# Altium schematic sheet [3] Sensor.SchDoc: Sensors
size A4; ApprovedBy: Muhammet YILDIZ; CheckedBy: Muhammet YILDIZ; Author: Muhammet YILDIZ; CompanyName: YıLDıZ IoT; DrawnBy: Muhammet YILDIZ; Engineer: Muhammet YILDIZ; Organization: YıLDıZ IoT; Address1: Elperek Mahallesi; Address2: Saray Sokak No:12; Address3: SAKARYA / TURKEY; Revision: 1; SheetNumber: 3; SheetTotal: 7; SheetSize: A4
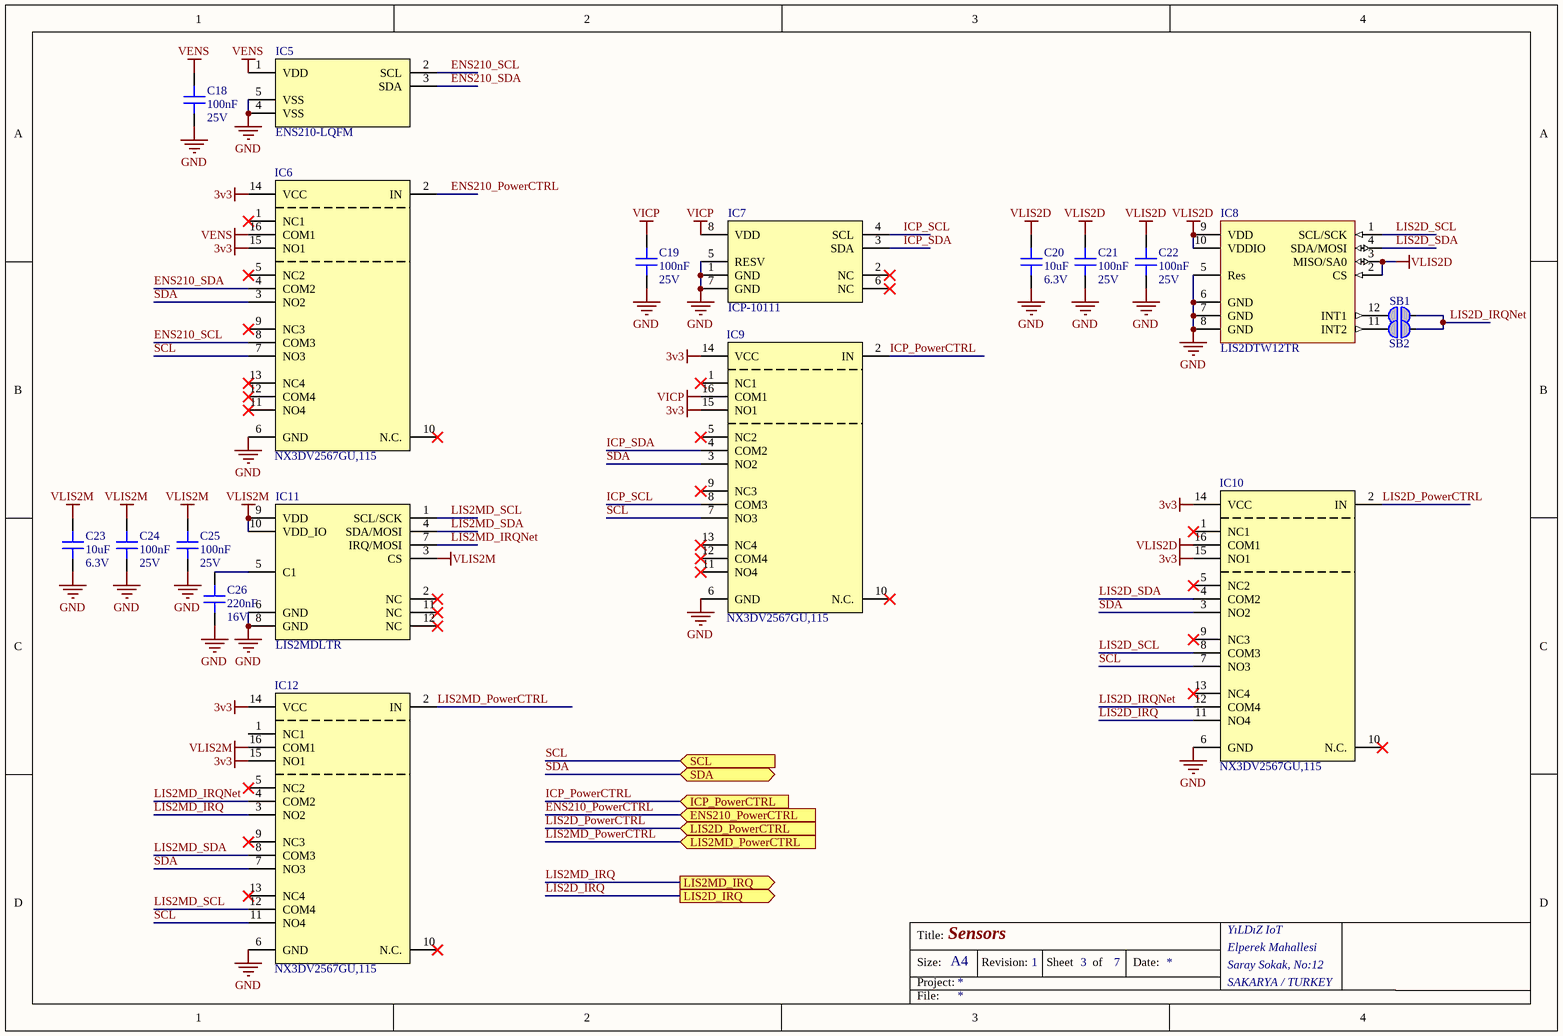
[diagram p0: [3] Sensor.SchDoc]

## Parts
C18  100nF  Voltage Rating (DC): 25V  [CAP 0402/1005]
C19  100nF  Voltage Rating (DC): 25V  [CAP 0402/1005]
C20  10uF  Voltage Rating: 6.3V  [CAP 0402/1005]
C21  100nF  Voltage Rating (DC): 25V  [CAP 0402/1005]
C22  100nF  Voltage Rating (DC): 25V  [CAP 0402/1005]
C23  10uF  Voltage Rating: 6.3V  [CAP 0402/1005]
C24  100nF  Voltage Rating (DC): 25V  [CAP 0402/1005]
C25  100nF  Voltage Rating (DC): 25V  [CAP 0402/1005]
C26  220nF  Voltage Rating: 16V  [CAP 0402/1005]
IC5  ENS210-LQFM  [SCIONSENSE ENS210LQFM]
IC6  NX3DV2567GU,115  [NXP XQFN16]
IC7  ICP-10111  [TDK ICP10111]
IC8  LIS2DTW12TR  [ST LGA-12 2x2x0.7]
IC9  NX3DV2567GU,115  [NXP XQFN16]
IC10  NX3DV2567GU,115  [NXP XQFN16]
IC11  LIS2MDLTR  [ST LGA-12 2x2x0.7]
IC12  NX3DV2567GU,115  [NXP XQFN16]
SB1  (no value)  [Solderbridge-Circular]  (no BOM)
SB2  (no value)  [Solderbridge-Circular]  (no BOM)

## Ports
ENS210_PowerCTRL (in), ICP_PowerCTRL (in), LIS2D_IRQ (out), LIS2D_PowerCTRL (in), LIS2MD_IRQ (out), LIS2MD_PowerCTRL (in), SCL (in), SDA (bidir)

## Nets
3v3: IC6.14(VCC) IC6.15(NO1) IC9.14(VCC) IC9.15(NO1) IC10.14(VCC) IC10.15(NO1) IC12.14(VCC) IC12.15(NO1)
GND: C18.1 C19.1 C20.1 C21.1 C22.1 C23.1 C24.1 C25.1 C26.1 IC5.4(VSS) IC5.5(VSS) IC6.6(GND) IC7.1(GND) IC7.5(RESV) IC7.7(GND) IC8.5(Res) IC8.6(GND) IC8.7(GND) IC8.8(GND) IC9.6(GND) IC10.6(GND) IC11.6(GND) IC11.8(GND) IC12.6(GND)
VENS: C18.2 IC5.1(VDD) IC6.16(COM1)
VICP: C19.2 IC7.8(VDD) IC9.16(COM1)
VLIS2D: C20.2 C21.2 C22.2 IC8.2(CS) IC8.3(MISO/SA0) IC8.9(VDD) IC8.10(VDDIO) IC10.16(COM1)
VLIS2M: C23.2 C24.2 C25.2 IC11.3(CS) IC11.9(VDD) IC11.10(VDD_IO) IC12.16(COM1)
ENS210_PowerCTRL: IC6.2(IN) ; port ENS210_PowerCTRL
ENS210_SCL: IC5.2(SCL) IC6.8(COM3)
ENS210_SDA: IC5.3(SDA) IC6.4(COM2)
ICP_PowerCTRL: IC9.2(IN) ; port ICP_PowerCTRL
ICP_SCL: IC7.4(SCL) IC9.8(COM3)
ICP_SDA: IC7.3(SDA) IC9.4(COM2)
LIS2D_IRQ: IC10.11(NO4) ; port LIS2D_IRQ
LIS2D_IRQNet: IC10.12(COM4) SB1.2 SB2.2
LIS2D_PowerCTRL: IC10.2(IN) ; port LIS2D_PowerCTRL
LIS2D_SCL: IC8.1(SCL/SCK) IC10.8(COM3)
LIS2D_SDA: IC8.4(SDA/MOSI) IC10.4(COM2)
LIS2MD_IRQ: IC12.3(NO2) ; port LIS2MD_IRQ
LIS2MD_IRQNet: IC11.7(IRQ/MOSI) IC12.4(COM2)
LIS2MD_PowerCTRL: IC12.2(IN) ; port LIS2MD_PowerCTRL
LIS2MD_SCL: IC11.1(SCL/SCK) IC12.12(COM4)
LIS2MD_SDA: IC11.4(SDA/MOSI) IC12.8(COM3)
SCL: IC6.7(NO3) IC9.7(NO3) IC10.7(NO3) IC12.11(NO4) ; port SCL
SDA: IC6.3(NO2) IC9.3(NO2) IC10.3(NO2) IC12.7(NO3) ; port SDA
NetC26_2: C26.2 IC11.5(C1)
NetIC8_11: IC8.11(INT2) SB2.1
NetIC8_12: IC8.12(INT1) SB1.1

Not connected (* = marked no-connect by the designer): IC6 1(NC1)* 5(NC2)* 9(NC3)* 10(N.C.)* 11(NO4)* 12(COM4)* 13(NC4)*; IC7 2(NC)* 6(NC)*; IC9 1(NC1)* 5(NC2)* 9(NC3)* 10(N.C.)* 11(NO4)* 12(COM4)* 13(NC4)*; IC10 1(NC1)* 5(NC2)* 9(NC3)* 10(N.C.)* 13(NC4)*; IC11 2(NC)* 11(NC)* 12(NC)*; IC12 1(NC1) 5(NC2)* 9(NC3)* 10(N.C.)* 13(NC4)*

## Notes on the sheet
- Title:
- Size:
- Project:
- Revision:
- Sheet
- of
- Date:
- YıLDıZ IoT
- Elperek Mahallesi
- Saray Sokak, No:12
- SAKARYA / TURKEY
- File:

## Library data of the parts
C18 C19 C21 C22 C24 C25 = Capacitor - Ceramic: Cap Ceramic 0.1uF 25V X5R 10% Pad SMD 0402 85¡ãC T/R / Multi Layer Ceramic Capacitor (MLCC); Manufacturer: Samsung; Manufacturer Part Number: CL05A104KA5NNNC; Supplier 1: Digi-Key; Supplier Part Number 1: 1276-1043-6-ND; RoHS: Yes; Category: Ceramic Capacitors; Pricing 1: 1=0,10000, 10=0,01100, 50=0,00600, 100=0,00490, 500=0,00346, 1000=0,00272, 2500=0,00248, 5000=0,00228 (USD); Mount: Surface Mount; Case/Package: 0402; Case Code (Imperial): 0402; Case Code (Metric): 1005; Min Operating Temperature: -55°C; Max Operating Temperature: 85°C; Capacitance: 100nF; Packaging: Tape and Reel; Tolerance: 10%; Package Quantity: 1; Voltage Rating: 25V; Dielectric: X5R; Voltage: 25V; Length: 1mm; Width: 0.02inch; Height: 0.5mm; Thickness: 0.022inch; Depth: 0.5mm; Radiation Hardening: No; Lead Free: Lead Free; ComponentLink1URL: https://datasheet.ciiva.com/25802/cl05a104ka5nnnc-25802704.pdf?src-supplier=Digi-Key; ComponentLink1Description: https://datasheet.ciiva.com/25802/cl05a104ka5nnnc-25802704.pdf?src-supplier=Digi-Key; ComponentLink2URL: https://datasheet.ciiva.com/16437/cl05a104ka5nnnc-16437369.pdf?src-supplier=Future+Electronics; ComponentLink2Description: https://datasheet.ciiva.com/16437/cl05a104ka5nnnc-16437369.pdf?src-supplier=Future+Electronics; ComponentLink3URL: https://datasheet.ciiva.com/26838/getdatasheetpartid-357412-26838142.pdf?src-supplier=Verical; ComponentLink3Description: https://datasheet.ciiva.com/26838/getdatasheetpartid-357412-26838142.pdf?src-supplier=Verical; ComponentLink4URL: https://datasheet.ciiva.com/26309/mlcc-catalogdownload2013-eng-26309014.pdf?src-supplier=Distrelec; ComponentLink4Description: https://datasheet.ciiva.com/26309/mlcc-catalogdownload2013-eng-26309014.pdf?src-supplier=Distrelec
C20 C23 = Capacitor - Ceramic: 0402 10 uF 6.3 V ±20 % Tolerance X5R Surface Mount Multilayer Ceramic Capacitor; Manufacturer: Murata; Manufacturer Part Number: GRM155R60J106ME15D; Tolerance: 20%; Supplier 1: Digi-Key; Supplier Part Number 1: 490-13238-1-ND; RoHS: Yes; Category: Ceramic Capacitors; Pricing 1: 1=0,18000, 10=0,12400, 50=0,07440, 100=0,06280, 500=0,04296, 1000=0,03800, 2500=0,03635, 5000=0,03304 (USD); Mount: Surface Mount; Case/Package: 0402; Case Code (Metric): 1005; Case Code (Imperial): 0402; Min Operating Temperature: -55°C; Max Operating Temperature: 85°C; Packaging: Tape and Reel; Capacitance: 10uF; Voltage Rating (DC): 6.3V; Dielectric: X5R; Length: 0.039inch; Width: 0.02inch; Thickness: 0.026inch; RoHS Compliant: Yes; ComponentLink1URL: https://www.murata.com/~/media/webrenewal/support/library/catalog/products/capacitor/mlcc/c02e.ashx?la=en-us&src-supplier=Digi-Key; ComponentLink1Description: https://www.murata.com/~/media/webrenewal/support/library/catalog/products/capacitor/mlcc/c02e.ashx?la=en-us&src-supplier=Digi-Key
C26 = Capacitor - Ceramic: Ceramic capacitor SMD-0402 220nF /16V X7R# K +-10%, Samsung, RoHS; Manufacturer Part Number: CL05B224KO5NNNC; Tolerance: 10%; Dielectric: X7R; Supplier 1: Digi-Key; Supplier Part Number 1: 1276-1176-1-ND; Manufacturer: Samsung; RoHS: Yes; Category: Ceramic Capacitors; Pricing 1: 1=0,10000, 10=0,03300, 50=0,01780, 100=0,01460, 500=0,01040, 1000=0,00817, 2500=0,00742, 5000=0,00683 (USD); Mount: Surface Mount; Case/Package: 0402; Case Code (Metric): 1005; Case Code (Imperial): 0402; Min Operating Temperature: -55°C; Max Operating Temperature: 125°C; Packaging: Tape and Reel; Capacitance: 220nF; Package Quantity: 1; Series: CL; Construction: Flat; Length: 1mm; Width: 0.02inch; Height: 0.5mm; Thickness: 0.022inch; Depth: 0.5mm; Radiation Hardening: No; RoHS Compliant: Yes; ComponentLink1URL: https://datasheet.ciiva.com/25800/cl05b224ko5nnnc-25800450.pdf?src-supplier=Digi-Key; ComponentLink1Description: https://datasheet.ciiva.com/25800/cl05b224ko5nnnc-25800450.pdf?src-supplier=Digi-Key; ComponentLink2URL: https://datasheet.ciiva.com/26838/getdatasheetpartid-358459-26838228.pdf?src-supplier=Verical; ComponentLink2Description: https://datasheet.ciiva.com/26838/getdatasheetpartid-358459-26838228.pdf?src-supplier=Verical; ComponentLink3URL: https://datasheet.ciiva.com/16428/cl05b224ko5nnnc-16428810.pdf?src-supplier=Future+Electronics; ComponentLink3Description: https://datasheet.ciiva.com/16428/cl05b224ko5nnnc-16428810.pdf?src-supplier=Future+Electronics
IC5 = SCIOSENSE ENS210-LQFM: ENS210 Series 3.6V 100%RH Relative Humidity & Temperature Sensor w/I²C Interface; Supplier 1: Digi-Key; Supplier Part Number 1: 2618-ENS210-LQFMCT-ND; Manufacturer: ScioSense; Manufacturer Part Number: ENS210-LQFM; Stock 1: 47662; Pricing 1: 1=2,87000, 5=2,66400, 10=2,21400, 25=1,84480, 50=1,64000, 100=1,55800, 500=1,31200, 1000=1,23000 (USD); ComponentLink1URL: https://datasheet.octopart.com/ENS210-LQFM-ScioSense-datasheet-149899868.pdf?src-supplier=Future+Electronics; ComponentLink1Description: https://datasheet.octopart.com/ENS210-LQFM-ScioSense-datasheet-149899868.pdf?src-supplier=Future+Electronics
IC6 IC9 IC10 IC12 = NXP NX3DV2567GU,115: NX3DV2567 Series 4.3 V 10.5 Ohm 4PDT Low-Ohmic Analog Switch - XQFN-16; Manufacturer: NXP Semiconductors; Number of Inputs: 4; Number of Outputs: 2; Number of Channels: 1; Min Supply Voltage: 1.4V; Max Supply Voltage: 4.3V; Max Power Dissipation: 250mW; On-State Resistance: 700mR; Operating Supply Current: 150nA; Turn-On Delay Time: 50ns; Turn-Off Delay Time: 30ns; Supply Type: Single; Supplier 1: Digi-Key; Supplier Part Number 1: 568-5206-1-ND; Manufacturer Part Number: NX3DV2567GU,115; RoHS: Yes; Category: Interface ICs; Stock 1: 5231; Pricing 1: 1=0,98000, 10=0,87300, 25=0,82880, 100=0,80340 (USD); Mount: Surface Mount; Number of Pins: 16; Min Operating Temperature: -40°C; Max Operating Temperature: 125°C; Package Quantity: 1; Packaging: Tape and Reel; Max Supply Current: 150nA; Power Dissipation: 250mW; Series: -; Radiation Hardening: No; Lead Free: Lead Free; RoHS Compliant: Yes; ComponentLink1URL: https://datasheet.ciiva.com/1667/nx3dv2567-1667296.pdf?src-supplier=Digi-Key; ComponentLink1Description: https://datasheet.ciiva.com/1667/nx3dv2567-1667296.pdf?src-supplier=Digi-Key; ComponentLink2URL: https://datasheet.ciiva.com/4917/nx3dv2567-42536-4917579.pdf?src-supplier=Mouser; ComponentLink2Description: https://datasheet.ciiva.com/4917/nx3dv2567-42536-4917579.pdf?src-supplier=Mouser; ComponentLink3URL: https://datasheet.ciiva.com/1667/nx3dv2567-1667295.pdf?src-supplier=Digi-Key; ComponentLink3Description: https://datasheet.ciiva.com/1667/nx3dv2567-1667295.pdf?src-supplier=Digi-Key; ComponentLink4URL: https://datasheet.ciiva.com/1667/nx3dv2567-1667294.pdf?src-supplier=Digi-Key; ComponentLink4Description: https://datasheet.ciiva.com/1667/nx3dv2567-1667294.pdf?src-supplier=Digi-Key; ComponentLink5URL: https://datasheet.ciiva.com/6638/nx3dv2567-6638700.pdf?src-supplier=Digi-Key; ComponentLink5Description: https://datasheet.ciiva.com/6638/nx3dv2567-6638700.pdf?src-supplier=Digi-Key
IC7 = TDK ICP-10111: Barometric Pressure/Temperature Sensor Digital 30kPa to 110kPa/-20 to 65°C 8-Pin LGA T/R; Manufacturer: TDK InvenSense; Output Type: I2C; Pressure Type: Differential; Operating Pressure: 15.95PSI; Port Style: No Port; Supplier 1: Digi-Key; Supplier Part Number 1: 1428-1145-1-ND; Manufacturer Part Number: ICP-10111; RoHS: No; Category: Pressure Sensors; Stock 1: 11029; Pricing 1: 1=4,26000, 5=3,76200, 10=3,32300, 25=2,69600, 50=2,38260, 100=2,31990, 500=1,94370, 1000=1,81830, 5000=1,69290 (USD); Case/Package: LGA; Number of Pins: 8; Min Operating Temperature: -40°C; Max Operating Temperature: 85°C; Termination: SMD/SMT; RoHS Compliant: No; ComponentLink1URL: https://product.tdk.com/info/en/documents/catalog_datasheet/capacitive-pressure/DS-000186-ICP-101xx-v1.1.pdf?src-supplier=Digi-Key; ComponentLink1Description: https://product.tdk.com/info/en/documents/catalog_datasheet/capacitive-pressure/DS-000186-ICP-101xx-v1.1.pdf?src-supplier=Digi-Key; ComponentLink2URL: https://product.tdk.com/info/en/documents/catalog_datasheet/capacitive-pressure/DS-000186-ICP-101xx-v1.0.pdf?src-supplier=Digi-Key; ComponentLink2Description: https://product.tdk.com/info/en/documents/catalog_datasheet/capacitive-pressure/DS-000186-ICP-101xx-v1.0.pdf?src-supplier=Digi-Key
IC8 = ST LIS2DE12TR: 3-axis MEMS Accelerometer and Temperature Sensor Digital Output 1.8V 12-Pin LGA T/R; Manufacturer: STMicroelectronics; Supplier 1: Digi-Key; Supplier Part Number 1: 497-19047-1-ND; Manufacturer Part Number: LIS2DTW12TR; RoHS: Yes; Category: Accelerometers; Stock 1: 8556; Pricing 1: 1=3,37000, 10=3,02400, 25=2,85880, 100=2,47750, 500=2,11750 (USD)
IC11 = ST LIS2MDLTR: LIS2MDL Series 3.6V 50 Hz High Performance 3-Axis Digital Magnetic Sensor-LGA-12; Manufacturer: STMicroelectronics; Output Type: SPI,I2C; Sensing Method: Magnetoresistive; Axis: X, Y, Z; Resolution: 16b; Bandwidth: 50Hz; Supplier 1: Digi-Key; Supplier Part Number 1: 497-17588-1-ND; Manufacturer Part Number: LIS2MDLTR; RoHS: Yes; Category: Inertial Measurement Units (IMUs); Stock 1: 4476; Pricing 1: 1=3,07000, 10=2,75500, 25=2,59880, 100=2,21410, 500=1,81912, 1000=1,73250 (USD); Case/Package: LGA; Number of Pins: 12; Min Operating Temperature: -40°C; Max Operating Temperature: 85°C; Packaging: Tape and Reel; RoHS Compliant: Yes; ComponentLink1URL: http://www.farnell.com/datasheets/2815952.pdf?src-supplier=Farnell; ComponentLink1Description: http://www.farnell.com/datasheets/2815952.pdf?src-supplier=Farnell; ComponentLink2URL: http://www.farnell.com/datasheets/2815952.pdf?src-supplier=Newark; ComponentLink2Description: http://www.farnell.com/datasheets/2815952.pdf?src-supplier=Newark; ComponentLink3URL: http://www.st.com/content/ccc/resource/technical/document/datasheet/group3/29/13/d1/e0/9a/4d/4f/30/DM00395193/files/DM00395193.pdf/jcr:content/translations/en.DM00395193.pdf?src-supplier=Digi-Key; ComponentLink3Description: http://www.st.com/content/ccc/resource/technical/document/datasheet/group3/29/13/d1/e0/9a/4d/4f/30/DM00395193/files/DM00395193.pdf/jcr:content/translations/en.DM00395193.pdf?src-supplier=Digi-Key
SB1 SB2 = SOLDERBRIDGE